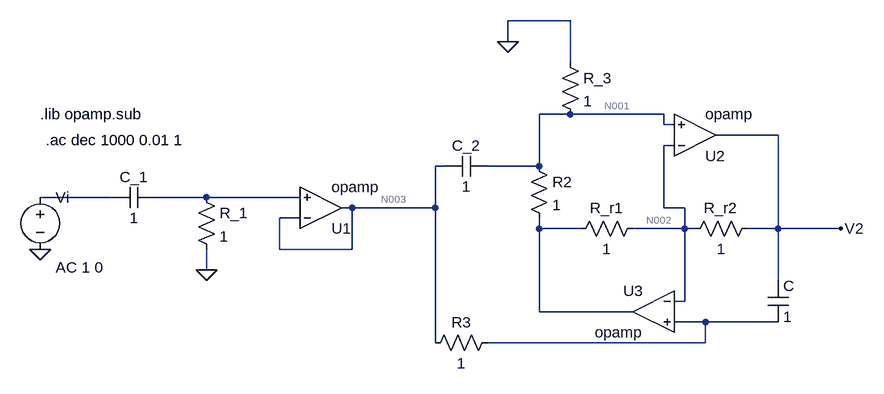
[diagram p0: schematic gic.asc]
gic.asc, the LTspice schematic file:
Version 4
SHEET 1 1284 680
WIRE 512 -256 416 -256
WIRE 416 -224 416 -256
WIRE 512 -192 512 -256
WIRE 512 -112 464 -112
WIRE 656 -112 512 -112
WIRE 656 -96 656 -112
WIRE 672 -96 656 -96
WIRE 832 -80 736 -80
WIRE 672 -64 656 -64
WIRE 320 -32 304 -32
WIRE 464 -32 464 -112
WIRE 464 -32 384 -32
WIRE -192 16 -304 16
WIRE -48 16 -128 16
WIRE 96 16 -48 16
WIRE 176 32 160 32
WIRE 304 32 304 -32
WIRE 304 32 176 32
WIRE 656 32 656 -64
WIRE 688 32 656 32
WIRE 96 48 64 48
WIRE 464 64 464 48
WIRE 528 64 464 64
WIRE 688 64 688 32
WIRE 688 64 608 64
WIRE 704 64 688 64
WIRE 832 64 832 -80
WIRE 832 64 784 64
WIRE 928 64 832 64
WIRE 64 96 64 48
WIRE 176 96 176 32
WIRE 176 96 64 96
WIRE -48 128 -48 96
WIRE 832 144 832 64
WIRE 688 176 688 64
WIRE 688 176 672 176
WIRE 464 192 464 64
WIRE 608 192 464 192
WIRE 720 208 672 208
WIRE 832 208 720 208
WIRE 304 240 304 32
WIRE 720 240 720 208
WIRE 720 240 384 240
FLAG -304 96 0
FLAG -48 128 0
FLAG 416 -224 0
FLAG 928 64 V2
SYMBOL voltage -304 0 R0
WINDOW 123 24 124 Left 2
WINDOW 39 0 0 Left 0
SYMATTR Value2 AC 1 0
SYMATTR InstName Vi
SYMATTR Value ""
SYMBOL res -64 0 R0
SYMATTR InstName R_1
SYMATTR Value 1
SYMBOL cap -128 0 R90
WINDOW 0 0 32 VBottom 2
WINDOW 3 32 32 VTop 2
SYMATTR InstName C_1
SYMATTR Value 1
SYMBOL Opamps\\opamp 128 96 M180
SYMATTR InstName U1
SYMBOL Opamps\\opamp 704 -16 M180
SYMATTR InstName U2
SYMBOL Opamps\\opamp 640 128 M0
SYMATTR InstName U3
SYMBOL cap 384 -48 R90
WINDOW 0 0 32 VBottom 2
WINDOW 3 32 32 VTop 2
SYMATTR InstName C_2
SYMATTR Value 1
SYMBOL res 400 224 R90
WINDOW 0 0 56 VBottom 2
WINDOW 3 32 56 VTop 2
SYMATTR InstName R3
SYMATTR Value 1
SYMBOL res 624 48 R90
WINDOW 0 0 56 VBottom 2
WINDOW 3 32 56 VTop 2
SYMATTR InstName R_r1
SYMATTR Value 1
SYMBOL res 800 48 R90
WINDOW 0 0 56 VBottom 2
WINDOW 3 32 56 VTop 2
SYMATTR InstName R_r2
SYMATTR Value 1
SYMBOL cap 816 144 R0
SYMATTR InstName C
SYMATTR Value 1
SYMBOL res 448 -48 R0
SYMATTR InstName R2
SYMATTR Value 1
SYMBOL res 496 -208 R0
SYMATTR InstName R_3
SYMATTR Value 1
TEXT -304 -112 Left 2 !.lib opamp.sub
TEXT -296 -72 Left 2 !.ac dec 1000 0.01 1

The netlist it stands for:
* gic.asc
Vi N004 0 AC 1 0
R_1 N005 0 1
C_1 N005 N004 1
XU1 N003 N005 N003 opamp Aol=100K GBW=10Meg  ; pins invin noninvin out
XU2 N002 N001 V2 opamp Aol=100K GBW=10Meg  ; pins invin noninvin out
XU3 N002 N007 N006 opamp Aol=100K GBW=10Meg  ; pins invin noninvin out
C_2 N001 N003 1
R3 N007 N003 1
R_r1 N002 N006 1
R_r2 V2 N002 1
C V2 N007 1
R2 N001 N006 1
R_3 0 N001 1
.lib opamp.sub
.ac dec 1000 0.01 1
.backanno
.end

* Results of the author's LTspice run, read from the files saved beside the schematic
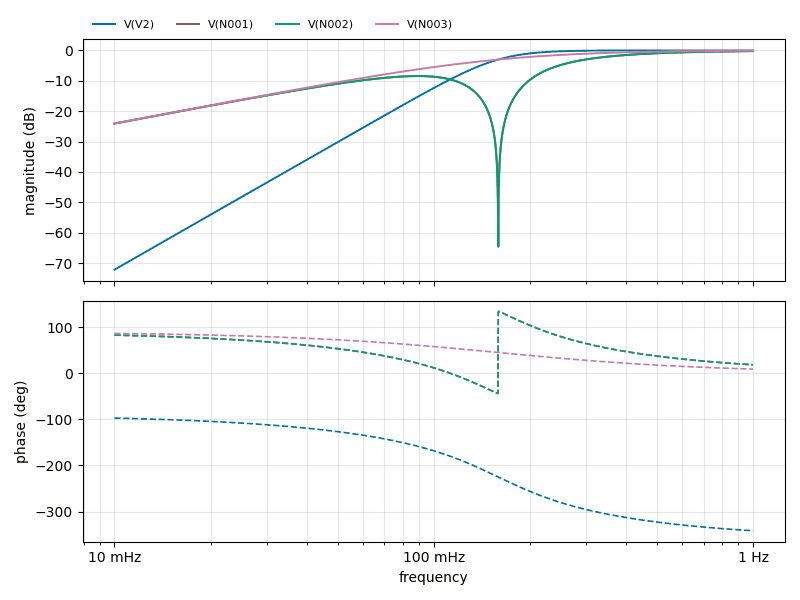
[diagram p1: AC Analysis of gic.asc, plotted from the saved traces]
* AC Analysis, 1 run:
*   V(V2): -72.15 dB at 10 mHz, -0.00 dB at 1 Hz, peak -0.00 dB at 1 Hz, 3 dB below the peak at 159.2 mHz
*   V(N001): -24.07 dB at 10 mHz, -0.22 dB at 1 Hz, peak -0.22 dB at 1 Hz, 3 dB below the peak at 289.9 mHz
*   V(N002): -24.07 dB at 10 mHz, -0.22 dB at 1 Hz, peak -0.22 dB at 1 Hz, 3 dB below the peak at 289.9 mHz
*   V(N003): -24.05 dB at 10 mHz, -0.11 dB at 1 Hz, peak -0.11 dB at 1 Hz, 3 dB below the peak at 155.3 mHz